# EAGLE schematic Super-Regenerative-Airband-1Transistor-Kamarudin2008 (EAGLE 7.6.0)
VHF Superregen for AM Aircraft Band by Kamarudin 2008 - arjip.wordpress.com https://arjip.wordpress.com/tag/airband-scanner/ https://arjip.wordpress.com/tag/super-regenerative/ http://radiobuilder.blogspot.ch/2012/10/airbandregen1t.html
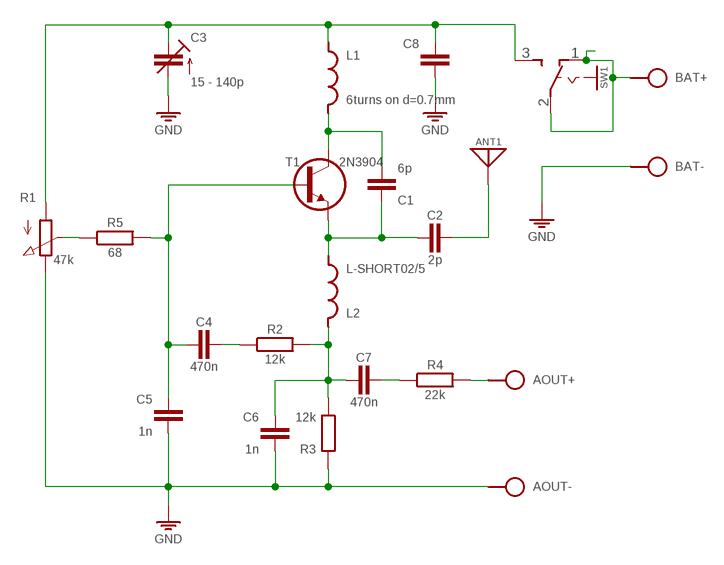
[diagram p0: schematic, sheet 1]

## Parts
ANT1  ANT  [SPAD]
AOUT+  SPAD  [SPAD]
AOUT-  SPAD  [SPAD]
BAT+  SPAD  [SPAD]
BAT-  SPAD  [SPAD]
C1  6p  C050-020X036  [C050-020X036]
C2  2p  C025-015X024  [C025-015X024]
C3  15 - 140p  C-TR-PH201272222-808-2PINB  [TRIM-2222-808]
C4  470n  C050-020X036  [C050-020X036]
C5  1n  C025-020X036  [C025-020X036]
C6  1n  C050-020X036  [C050-020X036]
C7  470n  C050-020X036  [C050-020X036]
C8  C050-025X075  [C050-025X075]
L1  6turns on d=0.7mm  L-SHORTL-04/7V-X  [L-04/7V-X]
L2  L-SHORT02/5  L-SHORT04-5/5V  [L-04-5/5V]
R1  47k  POT  [POT]
R2  12k  R-H0202/7  [0202/7]
R3  12k  R0202/7  [0202/7]
R4  22k  R-H0202/7  [0202/7]
R5  68  R-H0202/7  [0202/7]
SW1  SL-SW-1P-2T-H  [SLSW-1P2T-H]
T1  2N3904  [TO92]

## Nets
GND: AOUT-.1 BAT-.1 C3.2(A) C5.2 C6.2 C8.2 R1.3(E) R3.2
N$1: C1.2 L1.1 T1.3(C)
N$2: C1.1 C2.2 L2.1 T1.1(E)
N$3: C3.3(E) C8.1 L1.2 R1.1(A) SW1.3(S)
N$4: C4.2 C5.1 R5.2 T1.2(B)
N$5: ANT1.1 C2.1
N$6: BAT+.1 SW1.1(O) SW1.2(P)
N$7: C4.1 R2.1
N$8: C7.1 R4.1
N$10: AOUT+.1 R4.2
N$11: R1.2(S) R5.1
N$12: C6.1 C7.2 L2.2 R2.2 R3.1

## Library data of the parts
ANT1 = pad:ANT
AOUT+ AOUT- BAT+ BAT- = pad:SPAD
C1 C2 C4-C8 = c:C: CAPACITOR, European symbol
C3 = cap-trim:C-TR-PH20127
L1 L2 = l:L-SHORT
R1 = r:POT
R2 R4 R5 = r:R-H
R3 = r:R: RESISTOR, European symbol
SW1 = sw:SL-SW-1P-2T
T1 = t:2N3904

## Net classes
0 default: width 0.61 mm